# Altium schematic sheet DRV8301DCAR1_DRV8301DCAR.schdoc
size 127 x 99 mm
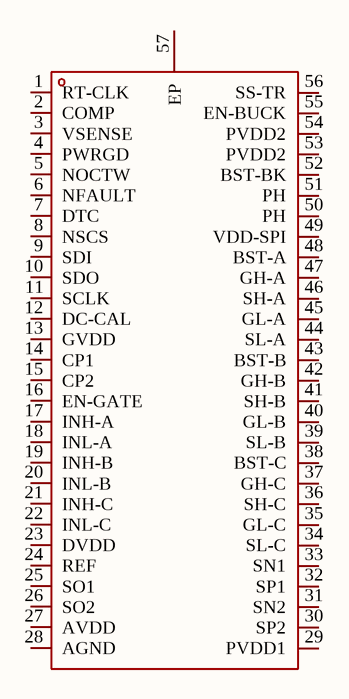
[diagram p0: DRV8301DCAR1_DRV8301DCAR.schdoc]

## Parts
U?  DRV8301DCAR  [HTSSOP-56_L14.0-W6.0-P0.50-LS8.0-BL]  (value not drawn)

## Nets

Not connected (* = marked no-connect by the designer): U? 1(RT-CLK) 2(COMP) 3(VSENSE) 4(PWRGD) 5(NOCTW) 6(NFAULT) 7(DTC) 8(NSCS) 9(SDI) 10(SDO) 11(SCLK) 12(DC-CAL) 13(GVDD) 14(CP1) 15(CP2) 16(EN-GATE) 17(INH-A) 18(INL-A) 19(INH-B) 20(INL-B) 21(INH-C) 22(INL-C) 23(DVDD) 24(REF) 25(SO1) 26(SO2) 27(AVDD) 28(AGND) 29(PVDD1) 30(SP2) 31(SN2) 32(SP1) 33(SN1) 34(SL-C) 35(GL-C) 36(SH-C) 37(GH-C) 38(BST-C) 39(SL-B) 40(GL-B) 41(SH-B) 42(GH-B) 43(BST-B) 44(SL-A) 45(GL-A) 46(SH-A) 47(GH-A) 48(BST-A) 49(VDD-SPI) 50(PH) 51(PH) 52(BST-BK) 53(PVDD2) 54(PVDD2) 55(EN-BUCK) 56(SS-TR) 57(EP)

## Library data of the parts
U? = DRV8301DCAR: Manufacturer: TI(德州仪器); Add into BOM: yes; Symbol: DRV8301DCAR; Device: DRV8301DCAR; LCSC Part Name: 无刷直流BLDC电机驱动芯片 60V; Supplier Part: C98969; Manufacturer Part: DRV8301DCAR; Supplier Footprint: HTSSOP-56-6mm; JLCPCB Part Class: Extended Part; Datasheet: https://www.ti.com/cn/lit/gpn/drv8301; Supplier: LCSC; Convert to PCB: yes